# EAGLE design CompleteBoardAlternative (EAGLE 9.4.2)
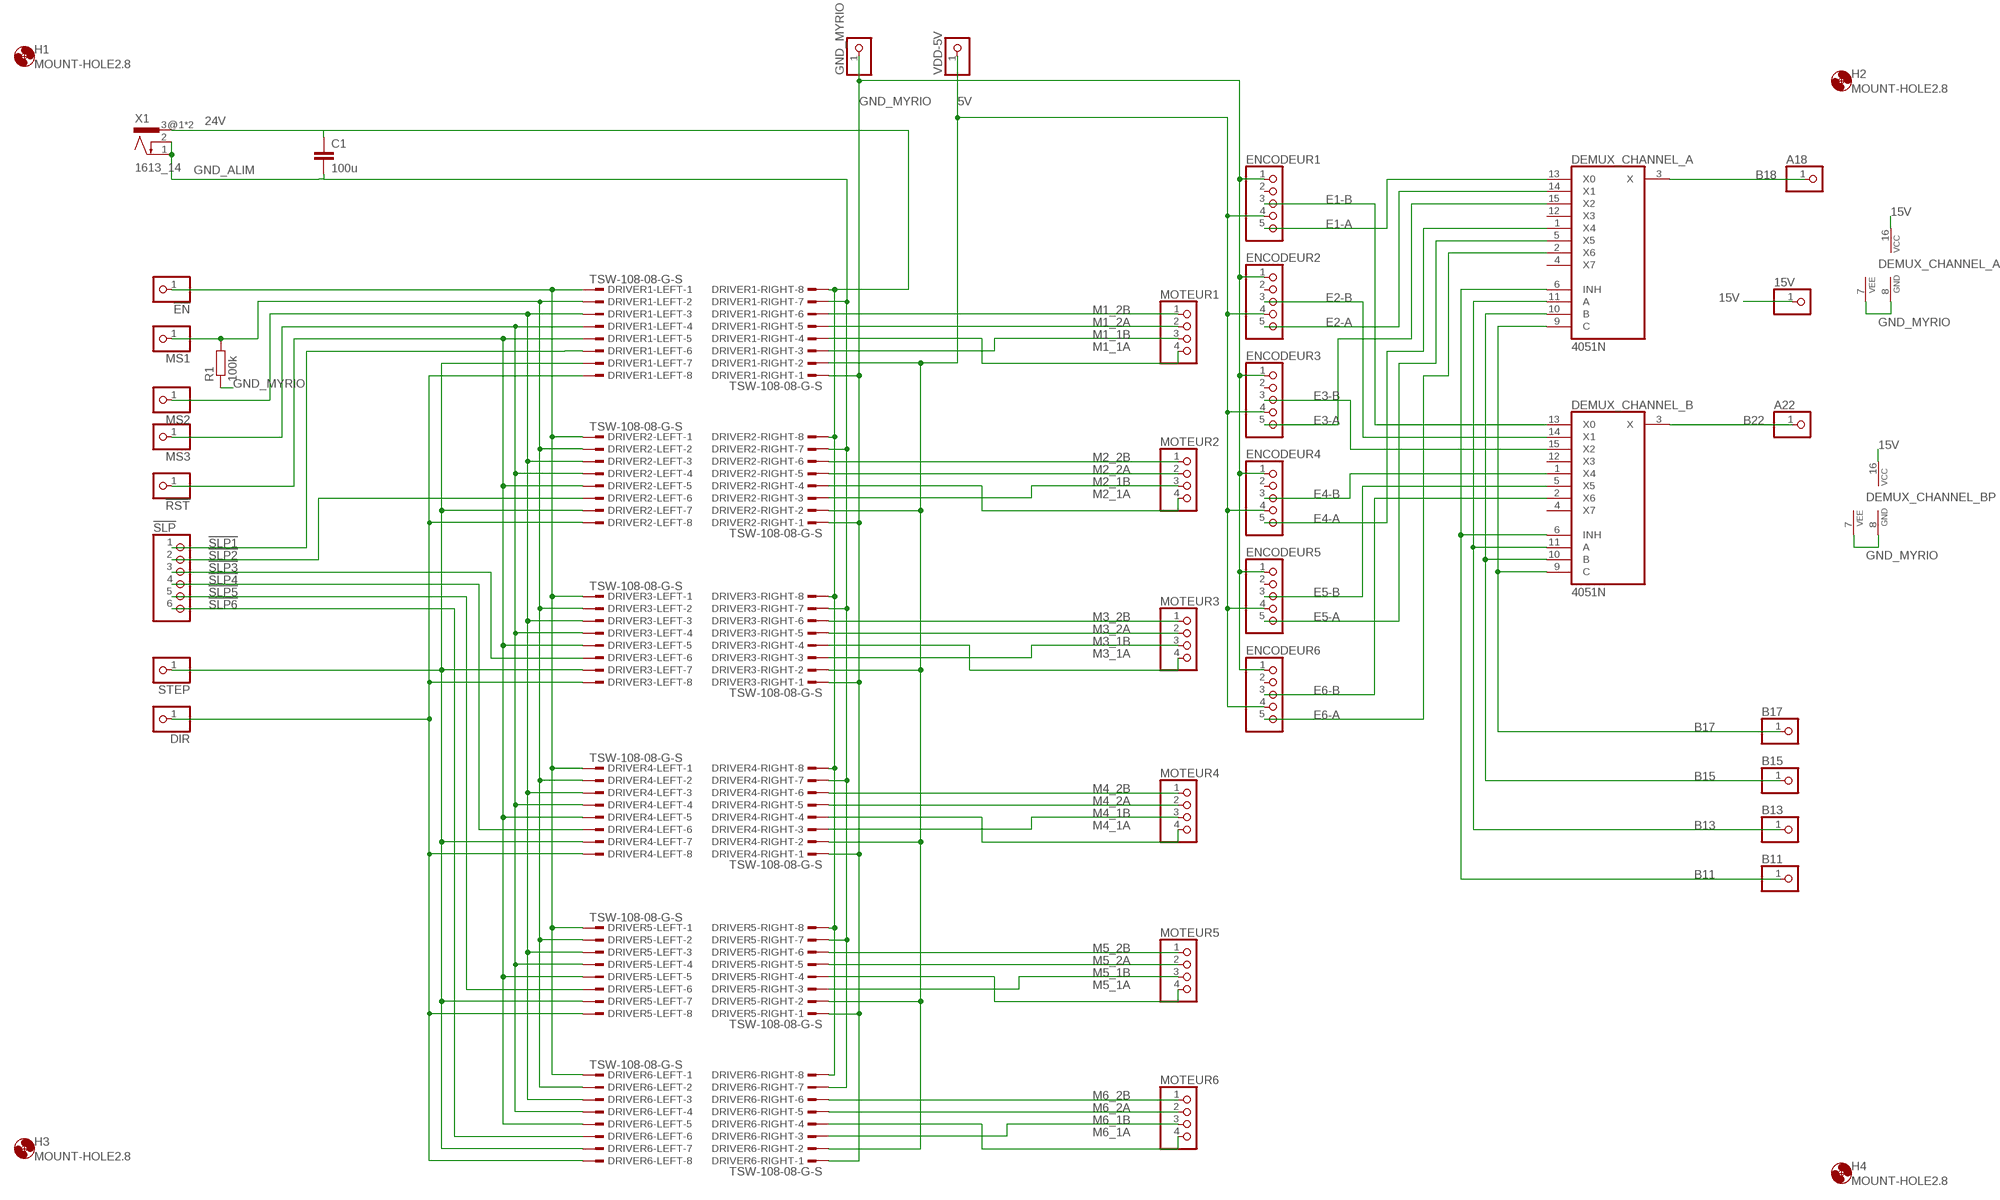
[diagram p0: schematic, sheet 1]

## Parts
15V  PINHD-1X1  [1X01]
!EN  PINHD-1X1  [1X01]
!RST  PINHD-1X1  [1X01]
!SLP  PINHD-1X6  [1X06]
A18  PINHD-1X1  [1X01]
A22  PINHD-1X1  [1X01]
B11  PINHD-1X1  [1X01]
B13  PINHD-1X1  [1X01]
B15  PINHD-1X1  [1X01]
B17  PINHD-1X1  [1X01]
C1  100u  C-EU025-025X050  [C025-025X050]
DEMUX_CHANNEL_A  4051N  [DIL16]
DEMUX_CHANNEL_B  4051N  [DIL16]
DIR  PINHD-1X1  [1X01]
DRIVER1-LEFT  TSW-108-08-G-S  [TSW-108-XX-G-S]
DRIVER1-RIGHT  TSW-108-08-G-S  [TSW-108-XX-G-S]
DRIVER2-LEFT  TSW-108-08-G-S  [TSW-108-XX-G-S]
DRIVER2-RIGHT  TSW-108-08-G-S  [TSW-108-XX-G-S]
DRIVER3-LEFT  TSW-108-08-G-S  [TSW-108-XX-G-S]
DRIVER3-RIGHT  TSW-108-08-G-S  [TSW-108-XX-G-S]
DRIVER4-LEFT  TSW-108-08-G-S  [TSW-108-XX-G-S]
DRIVER4-RIGHT  TSW-108-08-G-S  [TSW-108-XX-G-S]
DRIVER5-LEFT  TSW-108-08-G-S  [TSW-108-XX-G-S]
DRIVER5-RIGHT  TSW-108-08-G-S  [TSW-108-XX-G-S]
DRIVER6-LEFT  TSW-108-08-G-S  [TSW-108-XX-G-S]
DRIVER6-RIGHT  TSW-108-08-G-S  [TSW-108-XX-G-S]
ENCODEUR1  PINHD-1X5  [1X05]
ENCODEUR2  PINHD-1X5  [1X05]
ENCODEUR3  PINHD-1X5  [1X05]
ENCODEUR4  PINHD-1X5  [1X05]
ENCODEUR5  PINHD-1X5  [1X05]
ENCODEUR6  PINHD-1X5  [1X05]
GND_MYRIO  PINHD-1X1  [1X01]
H1  MOUNT-HOLE2.8  [2,8]
H2  MOUNT-HOLE2.8  [2,8]
H3  MOUNT-HOLE2.8  [2,8]
H4  MOUNT-HOLE2.8  [2,8]
MOTEUR1  PINHD-1X4  [1X04]
MOTEUR2  PINHD-1X4  [1X04]
MOTEUR3  PINHD-1X4  [1X04]
MOTEUR4  PINHD-1X4  [1X04]
MOTEUR5  PINHD-1X4  [1X04]
MOTEUR6  PINHD-1X4  [1X04]
MS1  PINHD-1X1  [1X01]
MS2  PINHD-1X1  [1X01]
MS3  PINHD-1X1  [1X01]
R1  100k  R-EU_0207/10  [0207/10]
STEP  PINHD-1X1  [1X01]
VDD-5V  PINHD-1X1  [1X01]
X1  1613_14  [1613_14]

## Nets
5V: DRIVER1-RIGHT.2 DRIVER2-RIGHT.2 DRIVER3-RIGHT.2 DRIVER4-RIGHT.2 DRIVER5-RIGHT.2 DRIVER6-RIGHT.2 ENCODEUR1.4 ENCODEUR2.4 ENCODEUR3.4 ENCODEUR4.4 ENCODEUR5.4 ENCODEUR6.4 VDD-5V.1
15V: 15V.1 DEMUX_CHANNEL_A.16(VCC) DEMUX_CHANNEL_B.16(VCC)
24V: C1.1 DRIVER1-RIGHT.8 DRIVER2-RIGHT.8 DRIVER3-RIGHT.8 DRIVER4-RIGHT.8 DRIVER5-RIGHT.8 DRIVER6-RIGHT.8 X1.3@1 X1.3@2
!ENABLE: !EN.1 DRIVER1-LEFT.1 DRIVER2-LEFT.1 DRIVER3-LEFT.1 DRIVER4-LEFT.1 DRIVER5-LEFT.1 DRIVER6-LEFT.1
!RESET: !RST.1 DRIVER1-LEFT.5 DRIVER2-LEFT.5 DRIVER3-LEFT.5 DRIVER4-LEFT.5 DRIVER5-LEFT.5 DRIVER6-LEFT.5
!SLP1: !SLP.1 DRIVER1-LEFT.6
!SLP2: !SLP.2 DRIVER2-LEFT.6
!SLP3: !SLP.3 DRIVER3-LEFT.6
!SLP4: !SLP.4 DRIVER4-LEFT.6
!SLP5: !SLP.5 DRIVER5-LEFT.6
!SLP6: !SLP.6 DRIVER6-LEFT.6
B11: B11.1 DEMUX_CHANNEL_A.6(INH) DEMUX_CHANNEL_B.6(INH)
B13: B13.1 DEMUX_CHANNEL_A.11(A) DEMUX_CHANNEL_B.11(A)
B15: B15.1 DEMUX_CHANNEL_A.10(B) DEMUX_CHANNEL_B.10(B)
B17: B17.1 DEMUX_CHANNEL_A.9(C) DEMUX_CHANNEL_B.9(C)
B18: A18.1 DEMUX_CHANNEL_A.3(X)
B22: A22.1 DEMUX_CHANNEL_B.3(X)
DIR: DIR.1 DRIVER1-LEFT.8 DRIVER2-LEFT.8 DRIVER3-LEFT.8 DRIVER4-LEFT.8 DRIVER5-LEFT.8 DRIVER6-LEFT.8
E1-A: DEMUX_CHANNEL_A.13(X0) ENCODEUR1.5
E1-B: DEMUX_CHANNEL_B.13(X0) ENCODEUR1.3
E2-A: DEMUX_CHANNEL_A.14(X1) ENCODEUR2.5
E2-B: DEMUX_CHANNEL_B.14(X1) ENCODEUR2.3
E3-A: DEMUX_CHANNEL_A.15(X2) ENCODEUR3.5
E3-B: DEMUX_CHANNEL_B.15(X2) ENCODEUR3.3
E4-A: DEMUX_CHANNEL_A.1(X4) ENCODEUR4.5
E4-B: DEMUX_CHANNEL_B.1(X4) ENCODEUR4.3
E5-A: DEMUX_CHANNEL_A.5(X5) ENCODEUR5.5
E5-B: DEMUX_CHANNEL_B.5(X5) ENCODEUR5.3
E6-A: DEMUX_CHANNEL_A.2(X6) ENCODEUR6.5
E6-B: DEMUX_CHANNEL_B.2(X6) ENCODEUR6.3
GND_ALIM: C1.2 DRIVER1-RIGHT.7 DRIVER2-RIGHT.7 DRIVER3-RIGHT.7 DRIVER4-RIGHT.7 DRIVER5-RIGHT.7 DRIVER6-RIGHT.7 X1.1 X1.2
GND_MYRIO: DEMUX_CHANNEL_A.7(VEE) DEMUX_CHANNEL_A.8(GND) DEMUX_CHANNEL_B.7(VEE) DEMUX_CHANNEL_B.8(GND) DRIVER1-RIGHT.1 DRIVER2-RIGHT.1 DRIVER3-RIGHT.1 DRIVER4-RIGHT.1 DRIVER5-RIGHT.1 DRIVER6-RIGHT.1 ENCODEUR1.1 ENCODEUR2.1 ENCODEUR3.1 ENCODEUR4.1 ENCODEUR5.1 ENCODEUR6.1 GND_MYRIO.1 R1.1
M1_1A: DRIVER1-RIGHT.4 MOTEUR1.4
M1_1B: DRIVER1-RIGHT.3 MOTEUR1.3
M1_2A: DRIVER1-RIGHT.5 MOTEUR1.2
M1_2B: DRIVER1-RIGHT.6 MOTEUR1.1
M2_1A: DRIVER2-RIGHT.4 MOTEUR2.4
M2_1B: DRIVER2-RIGHT.3 MOTEUR2.3
M2_2A: DRIVER2-RIGHT.5 MOTEUR2.2
M2_2B: DRIVER2-RIGHT.6 MOTEUR2.1
M3_1A: DRIVER3-RIGHT.4 MOTEUR3.4
M3_1B: DRIVER3-RIGHT.3 MOTEUR3.3
M3_2A: DRIVER3-RIGHT.5 MOTEUR3.2
M3_2B: DRIVER3-RIGHT.6 MOTEUR3.1
M4_1A: DRIVER4-RIGHT.4 MOTEUR4.4
M4_1B: DRIVER4-RIGHT.3 MOTEUR4.3
M4_2A: DRIVER4-RIGHT.5 MOTEUR4.2
M4_2B: DRIVER4-RIGHT.6 MOTEUR4.1
M5_1A: DRIVER5-RIGHT.4 MOTEUR5.4
M5_1B: DRIVER5-RIGHT.3 MOTEUR5.3
M5_2A: DRIVER5-RIGHT.5 MOTEUR5.2
M5_2B: DRIVER5-RIGHT.6 MOTEUR5.1
M6_1A: DRIVER6-RIGHT.4 MOTEUR6.4
M6_1B: DRIVER6-RIGHT.3 MOTEUR6.3
M6_2A: DRIVER6-RIGHT.5 MOTEUR6.2
M6_2B: DRIVER6-RIGHT.6 MOTEUR6.1
MS1: DRIVER1-LEFT.2 DRIVER2-LEFT.2 DRIVER3-LEFT.2 DRIVER4-LEFT.2 DRIVER5-LEFT.2 DRIVER6-LEFT.2 MS1.1 R1.2
MS2: DRIVER1-LEFT.3 DRIVER2-LEFT.3 DRIVER3-LEFT.3 DRIVER4-LEFT.3 DRIVER5-LEFT.3 DRIVER6-LEFT.3 MS2.1
MS3: DRIVER1-LEFT.4 DRIVER2-LEFT.4 DRIVER3-LEFT.4 DRIVER4-LEFT.4 DRIVER5-LEFT.4 DRIVER6-LEFT.4 MS3.1
STEP: DRIVER1-LEFT.7 DRIVER2-LEFT.7 DRIVER3-LEFT.7 DRIVER4-LEFT.7 DRIVER5-LEFT.7 DRIVER6-LEFT.7 STEP.1
Unconnected: DEMUX_CHANNEL_A.4(X7) DEMUX_CHANNEL_A.12(X3) DEMUX_CHANNEL_B.4(X7) DEMUX_CHANNEL_B.12(X3) ENCODEUR1.2 ENCODEUR2.2 ENCODEUR3.2 ENCODEUR4.2 ENCODEUR5.2 ENCODEUR6.2

## Library data of the parts
15V !EN !RST A18 A22 B11 B13 B15 B17 DIR GND_MYRIO MS1-MS3 STEP VDD-5V = pinhead:PINHD-1X1: PIN HEADER
!SLP = pinhead:PINHD-1X6: PIN HEADER
C1 = rcl:C-EU: CAPACITOR, European symbol; SPICEPREFIX: C
DEMUX_CHANNEL_A DEMUX_CHANNEL_B = 40xx:4051: 8-channel ANALOG MULTIPLEXER
DRIVER1-LEFT DRIVER1-RIGHT DRIVER2-LEFT DRIVER2-RIGHT DRIVER3-LEFT DRIVER3-RIGHT DRIVER4-LEFT DRIVER4-RIGHT DRIVER5-LEFT DRIVER5-RIGHT DRIVER6-LEFT DRIVER6-RIGHT = con-samtec:TSW-108-*-G-S: THROUGH-HOLE .025" SQ POST HEADER Source: Samtec TSW.pdf; MF: Samtec Inc.; MPN: TSW-108-07-G-S
ENCODEUR1-ENCODEUR6 = pinhead:PINHD-1X5: PIN HEADER
H1-H4 = holes:MOUNT-HOLE: MOUNTING HOLE with drill center marker
MOTEUR1-MOTEUR6 = pinhead:PINHD-1X4: PIN HEADER
R1 = rcl:R-EU_: RESISTOR, European symbol; SPICEPREFIX: R
X1 = con-lumberg:1613_14: Power supply connectors / Netzgeräte-Steckverbinder Source: Data sheet <http://www.farnell.com/datasheets/1733496.pdf>; MF: LUMBERG; MPN: 1613 14; OC_FARNELL: 1243245

## Board
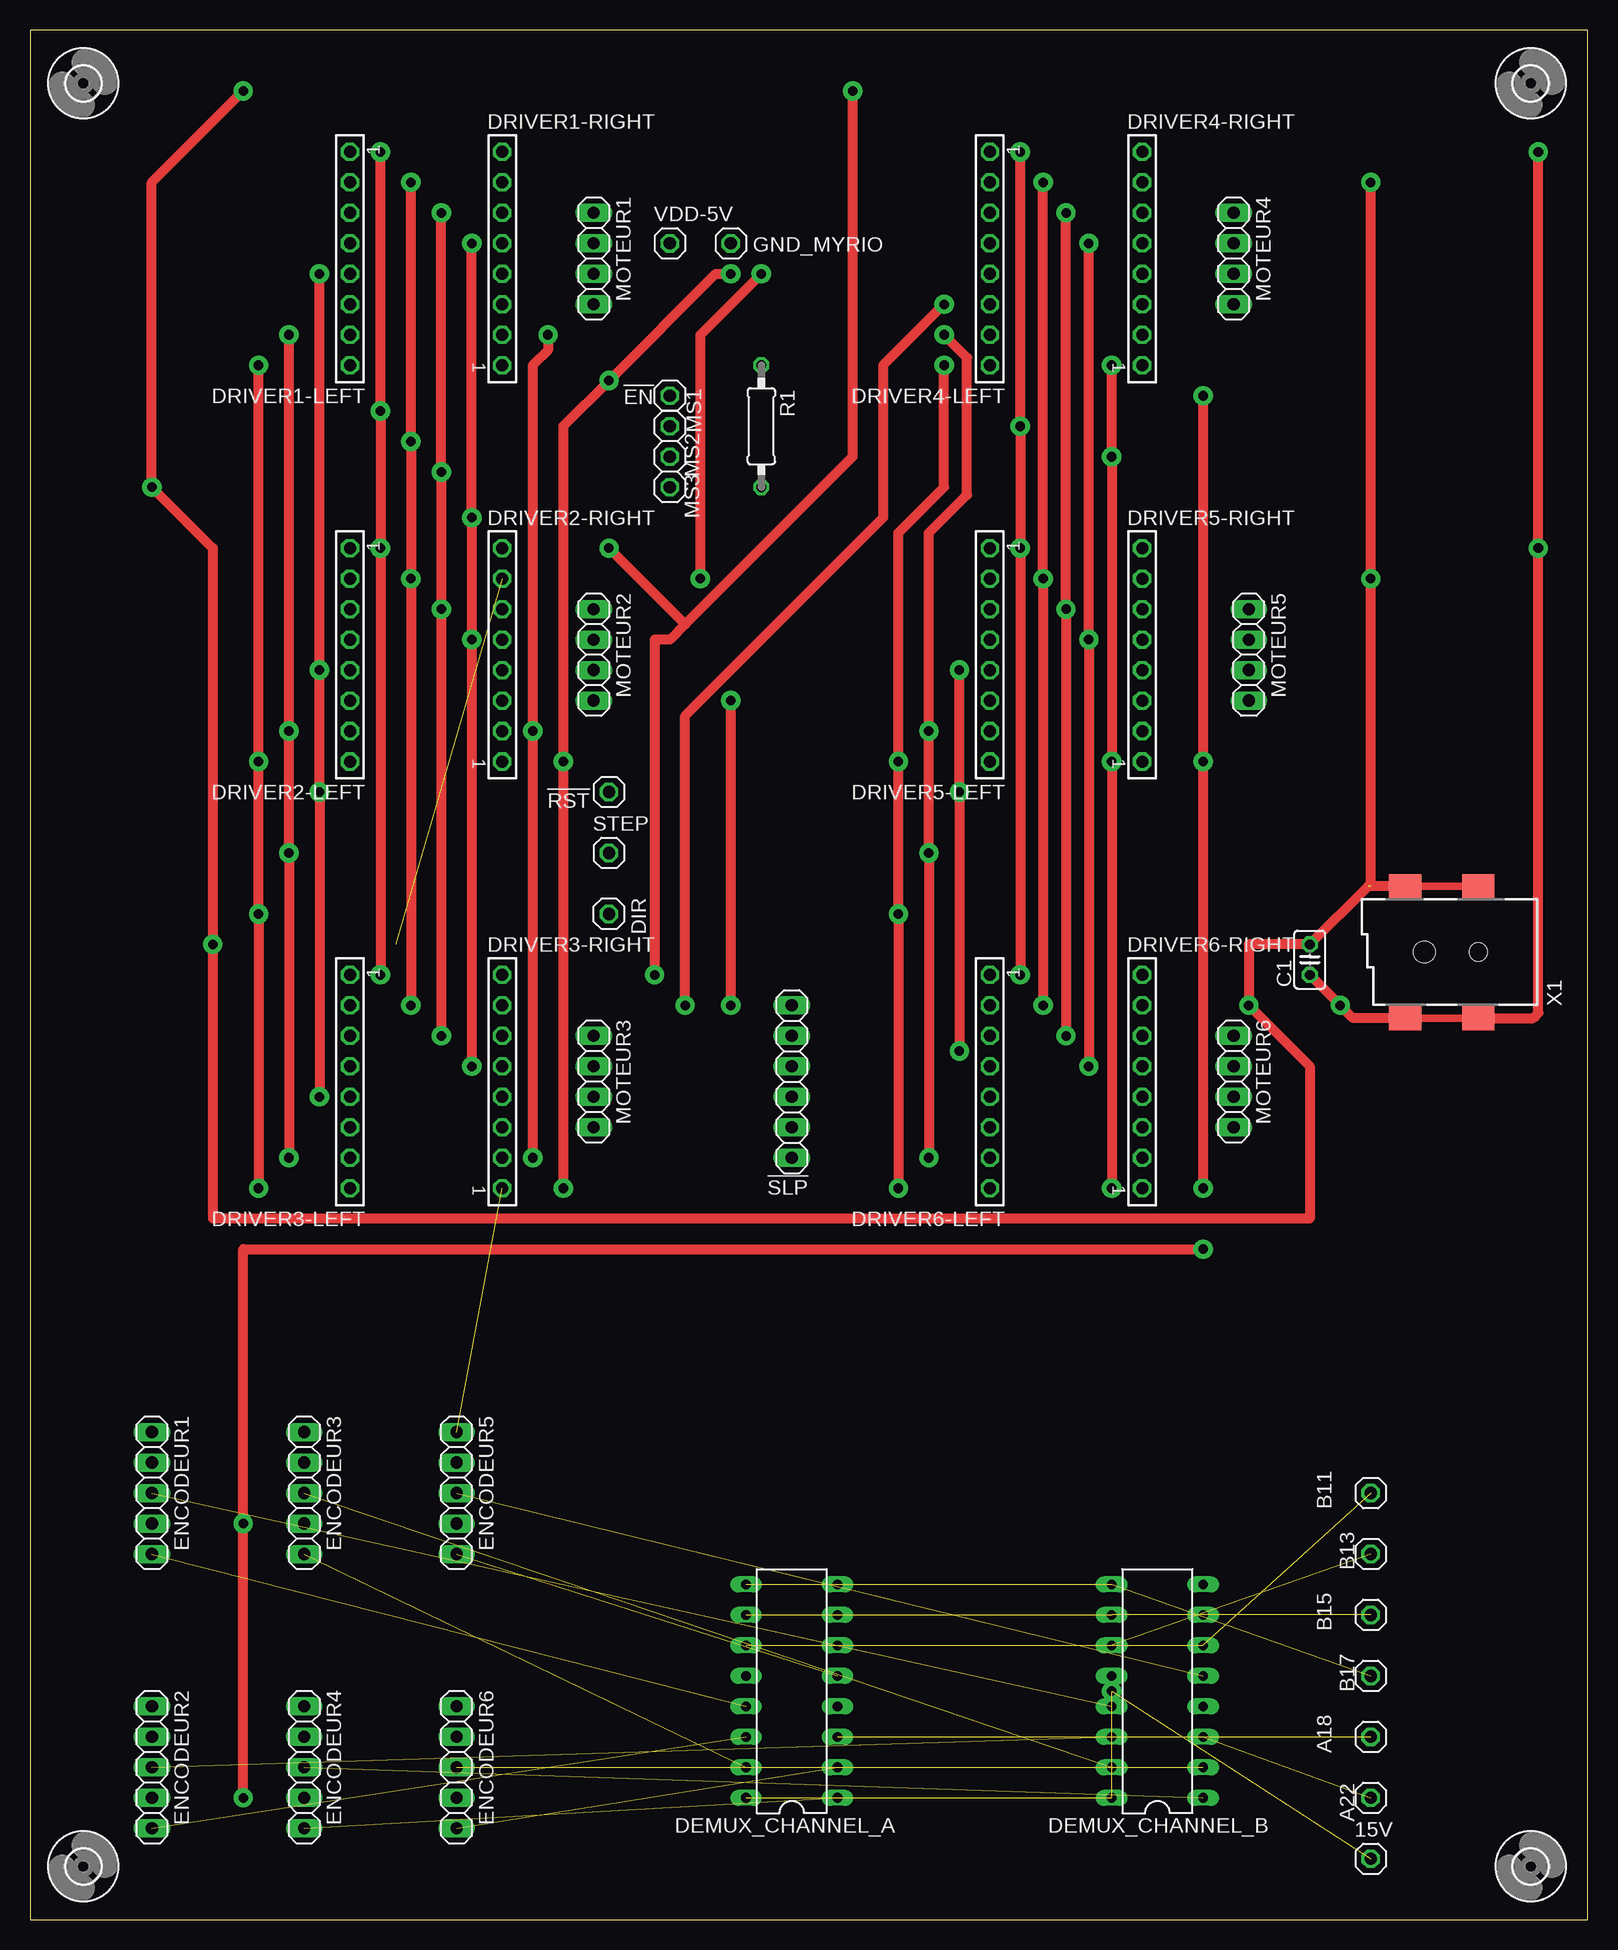
[diagram p1: board, top side]
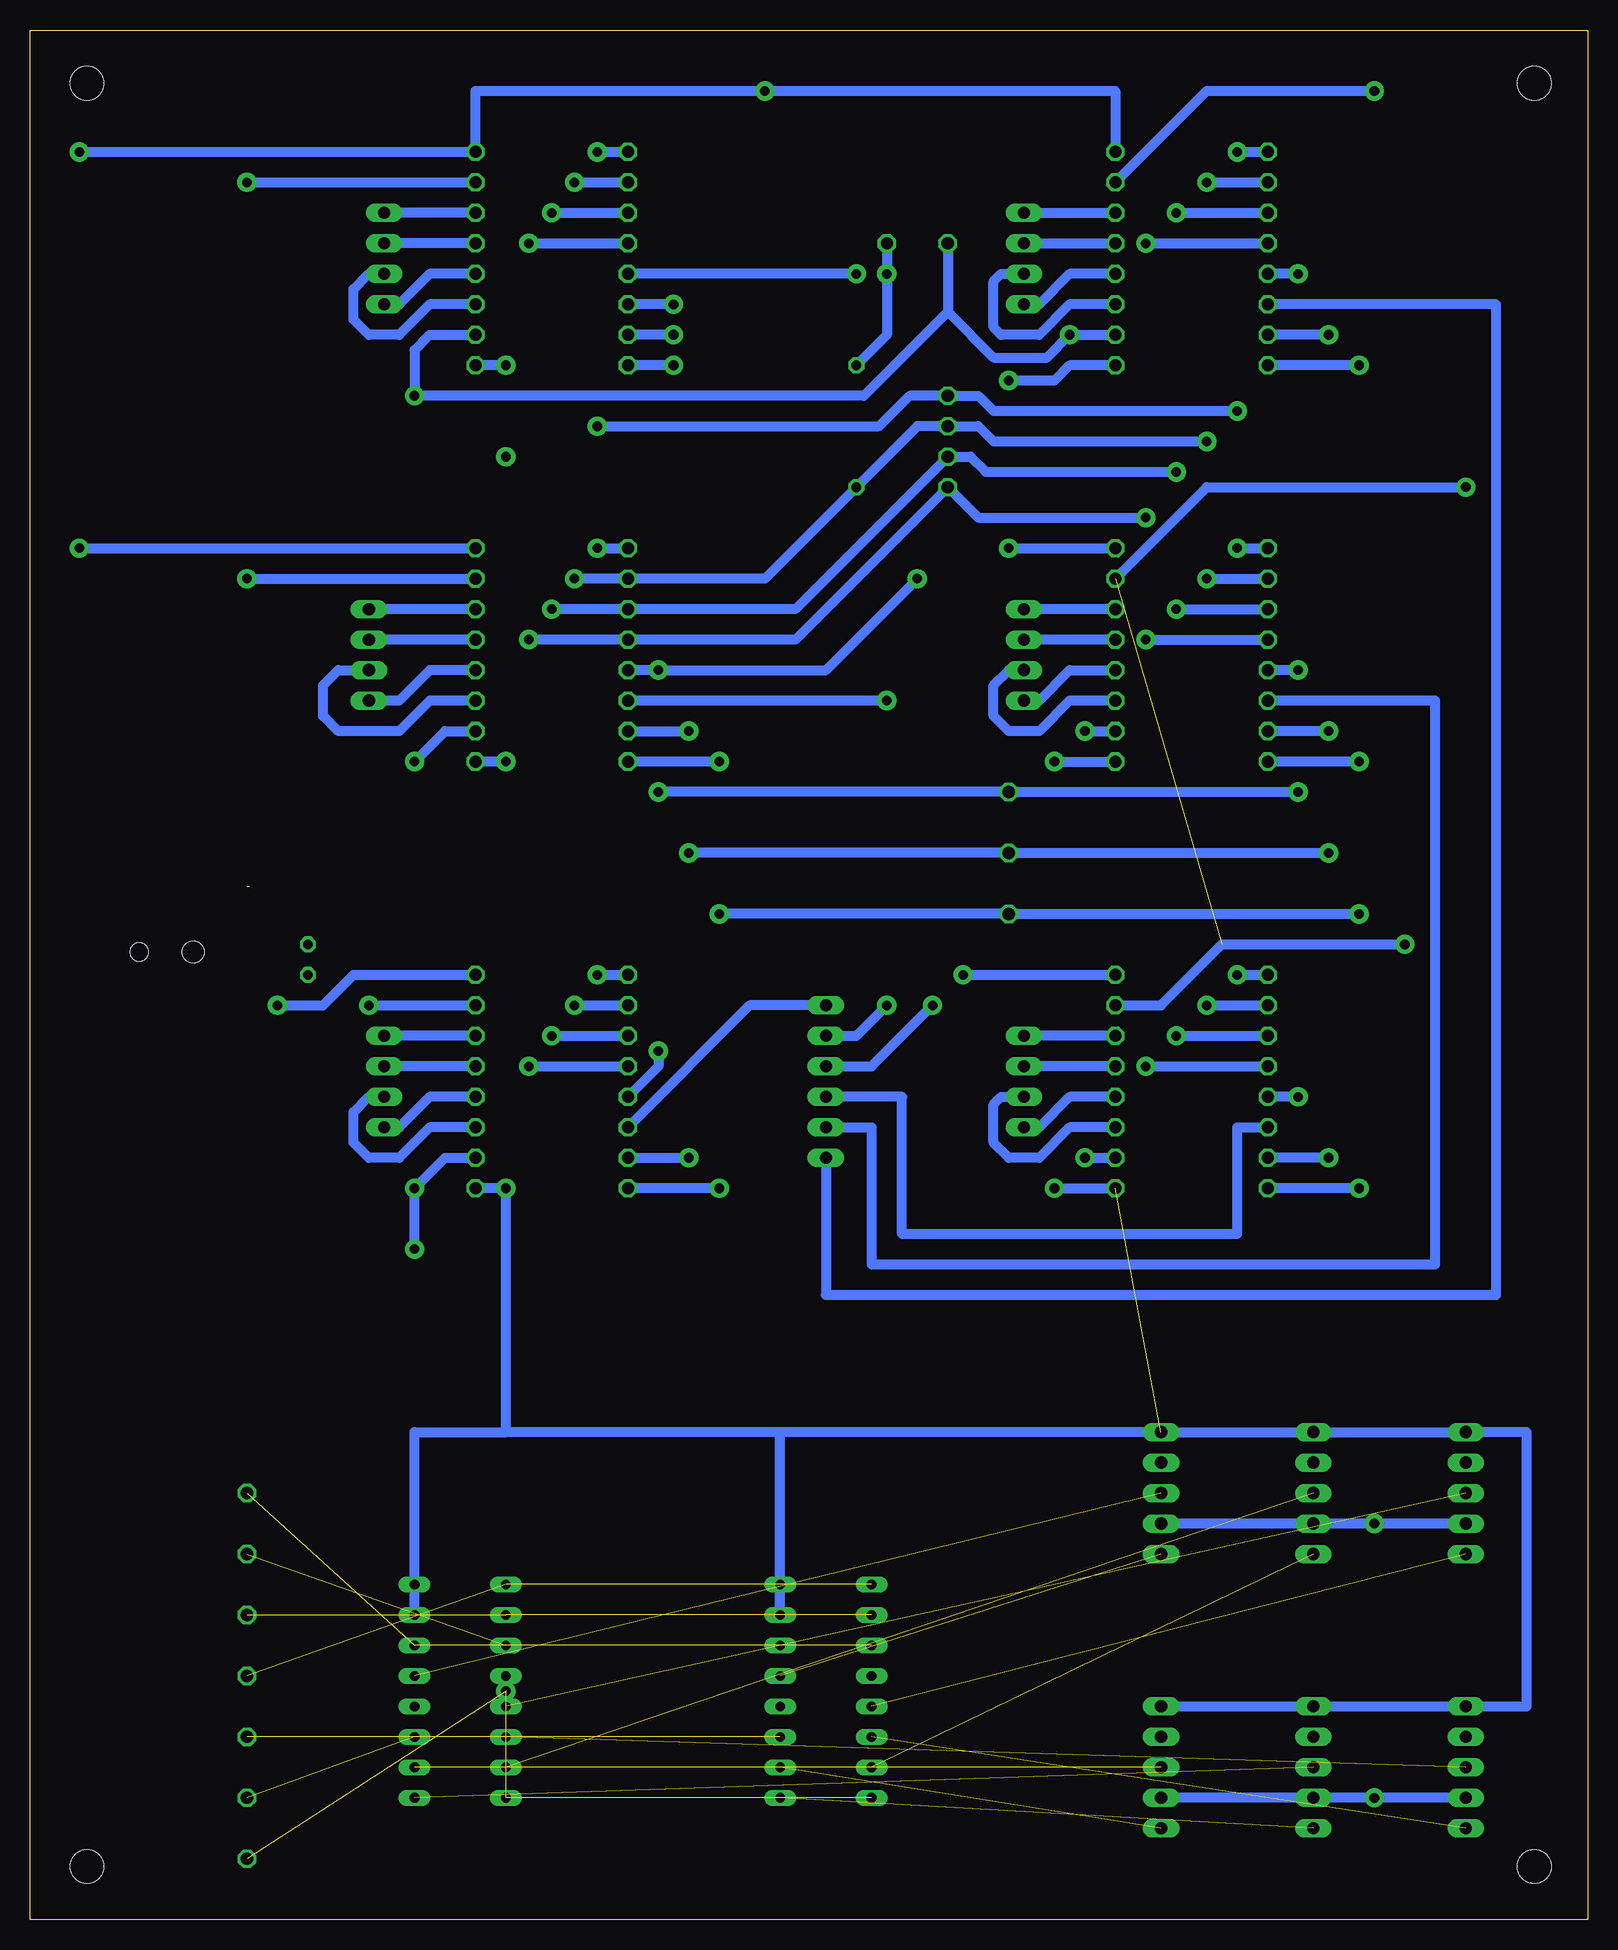
[diagram p2: board, bottom side, seen from below]

Size 129.84 x 157.48 mm. Coordinates in mm from the lower left corner, seen from the top.
Outline: 0,0 129.84,0 129.84,157.47 0,157.48 0,0
Copper layers (1*16): Top 0.035mm / dielectric 1.5mm / Bottom 0.035mm
Design rules "default": minimum track width 6mil, minimum drill 0.35mm, track to track 6mil, track to pad 6mil, pad to pad 6mil, via to via 6mil, smd to smd 6mil, copper to edge 40mil, drill to drill 6mil, minimum pad ring 10mil, minimum via ring 8mil, stop-mask expansion 4mil, vias tented up to drill 0mil, thermal gap 10mil

### Footprints (pad centres in the part's own frame; a part is rotated, then mirrored left to right if it is on the bottom)
1X01 = drill 1.016 octagon: 1 0,0
1X06 = drill 1.016 long: 1 -6.35,0; 2 -3.81,0; 3 -1.27,0; 4 1.27,0; 5 3.81,0; 6 6.35,0
C025-025X050 = drill 0.813 octagon: 1 -1.27,0; 2 1.27,0
DIL16 = drill 0.813 long: 1 -8.89,-3.81; 2 -6.35,-3.81; 3 -3.81,-3.81; 4 -1.27,-3.81; 5 1.27,-3.81; 6 3.81,-3.81; 7 6.35,-3.81; 8 8.89,-3.81; 9 8.89,3.81; 10 6.35,3.81; 11 3.81,3.81; 12 1.27,3.81; 13 -1.27,3.81; 14 -3.81,3.81; 15 -6.35,3.81; 16 -8.89,3.81
TSW-108-XX-G-S = drill 1 pad 1.5 octagon: 1 8.89,0; 2 6.35,0; 3 3.81,0; 4 1.27,0; 5 -1.27,0; 6 -3.81,0; 7 -6.35,0; 8 -8.89,0
1X05 = drill 1.016 long: 1 -5.08,0; 2 -2.54,0; 3 0,0; 4 2.54,0; 5 5.08,0
2,8 = hole 2.8: 0,0
1X04 = drill 1.016 long: 1 -3.81,0; 2 -1.27,0; 3 1.27,0; 4 3.81,0
0207/10 = drill 0.813 octagon: 1 -5.08,0; 2 5.08,0
1613_14 = smd 2 x 2.7: 1 5.5,5; 2 5.5,11.1; 3@1 -5.5,11.1; 3@2 -5.5,5 | hole 1.5: 0,5 | hole 1.8: 0,9.5

### Placement (x,y rotation side)
15V  111.76,5.08 0 top
!EN  53.34,127 270 top
!RST  48.26,93.98 0 top
!SLP  63.5,69.85 90 top
A18  111.76,15.24 0 top
A22  111.76,10.16 0 top
B11  111.76,35.56 0 top
B13  111.76,30.48 0 top
B15  111.76,25.4 0 top
B17  111.76,20.32 0 top
C1  106.68,80.01 90 top
DEMUX_CHANNEL_A  63.5,19.05 90 top
DEMUX_CHANNEL_B  93.98,19.05 90 top
DIR  48.26,83.82 270 top
DRIVER1-LEFT  26.67,138.43 90 top
DRIVER1-RIGHT  39.37,138.43 270 top
DRIVER2-LEFT  26.67,105.41 90 top
DRIVER2-RIGHT  39.37,105.41 270 top
DRIVER3-LEFT  26.67,69.85 90 top
DRIVER3-RIGHT  39.37,69.85 270 top
DRIVER4-LEFT  80.01,138.43 90 top
DRIVER4-RIGHT  92.71,138.43 270 top
DRIVER5-LEFT  80.01,105.41 90 top
DRIVER5-RIGHT  92.71,105.41 270 top
DRIVER6-LEFT  80.01,69.85 90 top
DRIVER6-RIGHT  92.71,69.85 270 top
ENCODEUR1  10.16,35.56 270 top
ENCODEUR2  10.16,12.7 270 top
ENCODEUR3  22.86,35.56 270 top
ENCODEUR4  22.86,12.7 270 top
ENCODEUR5  35.56,35.56 270 top
ENCODEUR6  35.56,12.7 270 top
GND_MYRIO  58.42,139.7 0 top
H1  4.45,153.03 0 top
H2  4.45,4.45 0 top
H3  125.09,153.03 0 top
H4  125.09,4.45 0 top
MOTEUR1  46.99,138.43 270 top
MOTEUR2  46.99,105.41 270 top
MOTEUR3  46.99,69.85 270 top
MOTEUR4  100.33,138.43 270 top
MOTEUR5  101.6,105.41 270 top
MOTEUR6  100.33,69.85 270 top
MS1  53.34,124.46 270 top
MS2  53.34,121.92 270 top
MS3  53.34,119.38 270 top
R1  60.96,124.46 270 top
STEP  48.26,88.9 0 top
VDD-5V  53.34,139.7 0 top
X1  125.73,80.64 90 top

### Tracks (layer width: path | path; a pad name or v marks a point on that pad's centre or on a via)
5V  (via drill 0.8 pad 1.6)
  Top 0.813: v97.79,127 v97.79,96.52 v97.79,60.96 | v43.18,132.08 43.18,130.81 41.91,129.54 v41.91,99.06 v41.91,63.5 | v17.78,10.16 v17.78,33.02 17.78,55.88 v97.79,55.88
  Bottom 0.813: VDD-5V.1 53.34,133.99 | 53.34,133.99 49.53,130.18 45.09,130.18 v43.18,132.08 DRIVER1-RIGHT.2 | DRIVER4-RIGHT.2 96.52,132.08 97.79,130.81 v97.79,127 60.33,127 53.34,133.99 | DRIVER6-RIGHT.2 95.25,63.5 v97.79,60.96 v97.79,55.88 | v97.79,96.52 95.25,99.06 DRIVER5-RIGHT.2 | v41.91,63.5 DRIVER3-RIGHT.2 | v41.91,99.06 DRIVER2-RIGHT.2 | ENCODEUR2.4 v17.78,10.16 ENCODEUR4.4 ENCODEUR6.4 | ENCODEUR1.4 v17.78,33.02 ENCODEUR3.4 ENCODEUR5.4
15V  (via drill 0.8 pad 1.6)  (3 unrouted)
  other vias: 90.17,19.05
24V  (via drill 0.8 pad 1.6)
  Top 0.61: X1.3@2 X1.3@1
  Top 0.813: X1.3@1 110.28,75.14 v109.22,76.2 C1.1 | X1.3@2 125.31,75.14 125.73,75.56 v125.73,114.3 v125.73,147.32 | v68.58,152.4 68.58,121.92 54.61,107.95 | 54.61,107.95 53.34,106.68 52.07,106.68 v52.07,78.74 | 54.61,107.95 v48.26,114.3
  Bottom 0.813: v109.22,76.2 105.41,76.2 102.87,78.74 DRIVER6-RIGHT.8 | v125.73,147.32 DRIVER4-RIGHT.8 92.71,152.4 v68.58,152.4 39.37,152.4 DRIVER1-RIGHT.8 | v125.73,114.3 DRIVER5-RIGHT.8 | v48.26,114.3 DRIVER2-RIGHT.8 | v52.07,78.74 DRIVER3-RIGHT.8
!ENABLE  (via drill 0.8 pad 1.6)
  Top 0.813: v29.21,147.32 v29.21,125.73 v29.21,114.3 v29.21,78.74 | v82.55,78.74 v82.55,114.3 v82.55,124.46 v82.55,147.32
  Bottom 0.813: v29.21,125.73 49.53,125.73 50.8,127 !EN.1 56.52,127 59.05,124.46 v82.55,124.46 | v29.21,78.74 DRIVER3-LEFT.1 | v82.55,147.32 DRIVER4-LEFT.1 | v82.55,114.3 DRIVER5-LEFT.1 | v82.55,78.74 DRIVER6-LEFT.1 | v29.21,114.3 DRIVER2-LEFT.1 | v29.21,147.32 DRIVER1-LEFT.1
!RESET  (via drill 0.8 pad 1.6)
  Top 0.813: v24.13,137.16 v24.13,104.14 v24.13,93.98 v24.13,68.58 | v77.47,72.39 v77.47,93.98 v77.47,104.14 | v55.88,111.76 55.88,132.08 v60.96,137.16
  Bottom 0.813: v24.13,93.98 !RST.1 v77.47,93.98 | v24.13,68.58 DRIVER3-LEFT.5 | v24.13,104.14 DRIVER2-LEFT.5 | v24.13,137.16 DRIVER1-LEFT.5 | DRIVER5-LEFT.5 v77.47,104.14 63.5,104.14 v55.88,111.76 | v77.47,72.39 77.47,71.12 DRIVER6-LEFT.5 | v60.96,137.16 DRIVER4-LEFT.5
!SLP1
  Bottom 0.813: !SLP.1 63.5,52.07 7.62,52.07 7.62,134.62 DRIVER1-LEFT.6
!SLP2
  Bottom 0.813: !SLP.2 59.69,66.04 59.69,54.61 12.7,54.61 12.7,101.6 DRIVER2-LEFT.6
!SLP3
  Bottom 0.813: DRIVER3-LEFT.6 29.21,66.04 29.21,57.15 57.15,57.15 57.15,68.58 !SLP.3
!SLP4  (via drill 0.8 pad 1.6)
  Top 0.813: v54.61,76.2 54.61,100.33 71.12,116.84 71.12,129.54 v76.2,134.62
  Bottom 0.813: !SLP.4 59.69,71.12 v54.61,76.2 | v76.2,134.62 DRIVER4-LEFT.6
!SLP5  (via drill 0.8 pad 1.6)
  Top 0.813: v58.42,76.2 v58.42,101.6
  Bottom 0.813: !SLP.5 60.96,73.66 v58.42,76.2 | v58.42,101.6 DRIVER5-LEFT.6
!SLP6
  Bottom 0.813: !SLP.6 69.85,76.2 DRIVER6-LEFT.6
B11  (2 unrouted)
B13  (2 unrouted)
B15  (2 unrouted)
B17  (2 unrouted)
B18  (1 unrouted)
B22  (1 unrouted)
DIR  (via drill 0.8 pad 1.6)
  Top 0.813: v19.05,129.54 v19.05,96.52 v19.05,83.82 v19.05,60.96 | v72.39,60.96 v72.39,83.82 v72.39,96.52 72.39,115.57 76.2,119.38 v76.2,129.54
  Bottom 0.813: v19.05,83.82 DIR.1 v72.39,83.82 | v19.05,60.96 DRIVER3-LEFT.8 | v19.05,96.52 DRIVER2-LEFT.8 | v19.05,129.54 DRIVER1-LEFT.8 | v76.2,129.54 DRIVER4-LEFT.8 | v72.39,96.52 DRIVER5-LEFT.8 | v72.39,60.96 DRIVER6-LEFT.8
E1-A  (1 unrouted)
E1-B  (1 unrouted)
E2-A  (1 unrouted)
E2-B  (1 unrouted)
E3-A  (1 unrouted)
E3-B  (1 unrouted)
E4-A  (1 unrouted)
E4-B  (1 unrouted)
E5-A  (1 unrouted)
E5-B  (1 unrouted)
E6-A  (1 unrouted)
E6-B  (1 unrouted)
GND_ALIM  (via drill 0.8 pad 1.6)  (2 unrouted)
  Top 0.61: X1.1 X1.2 114.42,86.36
  Top 0.813: 111.55,86.14 C1.2 101.6,81.28 v101.6,76.2 106.68,71.12 106.68,58.42 15.24,58.42 v15.24,81.28 15.24,114.3 v10.16,119.38 10.16,144.78 v17.78,152.4 | X1.2 111.76,86.14 v111.76,111.76 v111.76,144.78
  Bottom 0.813: v101.6,76.2 DRIVER6-RIGHT.7 | v111.76,111.76 DRIVER5-RIGHT.7 | v111.76,144.78 DRIVER4-RIGHT.7 | DRIVER1-RIGHT.7 31.75,152.4 v17.78,152.4 | DRIVER2-RIGHT.7 31.75,119.38 v10.16,119.38 | DRIVER3-RIGHT.7 35.56,76.2 30.48,81.28 v15.24,81.28
GND_MYRIO  (via drill 0.8 pad 1.6)  (1 unrouted)
  Top 0.813: v90.17,129.54 v90.17,121.92 v90.17,96.52 v90.17,60.96 | v58.42,137.16 57.15,137.16 v48.26,128.27 44.45,124.46 v44.45,96.52 v44.45,60.96
  Bottom 0.813: v90.17,129.54 DRIVER4-RIGHT.1 | v90.17,96.52 DRIVER5-RIGHT.1 | DRIVER6-RIGHT.1 v90.17,60.96 90.17,40.64 | R1.1 58.42,132.08 v58.42,137.16 GND_MYRIO.1 | DRIVER1-RIGHT.1 43.18,129.54 44.45,128.27 v48.26,128.27 | v44.45,60.96 DRIVER3-RIGHT.1 | v44.45,96.52 DRIVER2-RIGHT.1 | 67.31,40.64 ENCODEUR5.1 ENCODEUR3.1 ENCODEUR1.1 5.08,40.64 5.08,17.78 ENCODEUR2.1 ENCODEUR4.1 ENCODEUR6.1 | 67.31,40.64 90.17,40.64 | DEMUX_CHANNEL_A.7 DEMUX_CHANNEL_A.8 67.31,40.64 | DEMUX_CHANNEL_B.7 DEMUX_CHANNEL_B.8 97.79,40.64 90.17,40.64
M1_1A
  Bottom 0.813: DRIVER1-RIGHT.4 43.18,137.16 45.72,134.62 MOTEUR1.4
M1_1B
  Bottom 0.813: DRIVER1-RIGHT.3 43.18,134.62 45.72,132.08 48.9,132.08 49.53,132.72 49.53,136.53 48.9,137.16 MOTEUR1.3
M1_2A
  Bottom 0.813: MOTEUR1.2 DRIVER1-RIGHT.5
M1_2B
  Bottom 0.813: MOTEUR1.1 DRIVER1-RIGHT.6
M2_1A
  Bottom 0.813: MOTEUR2.4 45.72,101.6 43.18,104.14 DRIVER2-RIGHT.4
M2_1B
  Bottom 0.813: DRIVER2-RIGHT.3 43.18,101.6 45.72,99.06 48.26,99.06 49.53,100.33 49.53,102.87 48.26,104.14 MOTEUR2.3
M2_2A
  Bottom 0.813: DRIVER2-RIGHT.5 MOTEUR2.2
M2_2B
  Bottom 0.813: DRIVER2-RIGHT.6 MOTEUR2.1
M3_1A
  Bottom 0.813: DRIVER3-RIGHT.4 43.18,68.58 45.72,66.04 MOTEUR3.4
M3_1B
  Bottom 0.813: DRIVER3-RIGHT.3 43.18,66.04 45.72,63.5 48.26,63.5 49.53,64.77 49.53,67.94 48.9,68.58 MOTEUR3.3
M3_2A
  Bottom 0.813: DRIVER3-RIGHT.5 MOTEUR3.2
M3_2B
  Bottom 0.813: DRIVER3-RIGHT.6 MOTEUR3.1
M4_1A
  Bottom 0.813: DRIVER4-RIGHT.4 96.52,137.16 99.06,134.62 MOTEUR4.4
M4_1B
  Bottom 0.813: DRIVER4-RIGHT.3 96.52,134.62 99.06,132.08 101.6,132.08 102.87,133.35 102.87,135.89 101.6,137.16 MOTEUR4.3
M4_2A
  Bottom 0.813: DRIVER4-RIGHT.5 MOTEUR4.2
M4_2B
  Bottom 0.813: DRIVER4-RIGHT.6 MOTEUR4.1
M5_1A
  Bottom 0.813: DRIVER5-RIGHT.4 96.52,104.14 99.06,101.6 MOTEUR5.4
M5_1B
  Bottom 0.813: DRIVER5-RIGHT.3 96.52,101.6 99.06,99.06 104.14,99.06 105.41,100.33 105.41,102.87 104.14,104.14 MOTEUR5.3
M5_2A
  Bottom 0.813: DRIVER5-RIGHT.5 MOTEUR5.2
M5_2B
  Bottom 0.813: DRIVER5-RIGHT.6 MOTEUR5.1
M6_1A
  Bottom 0.813: DRIVER6-RIGHT.4 96.52,68.58 99.06,66.04 MOTEUR6.4
M6_1B
  Bottom 0.813: DRIVER6-RIGHT.3 96.52,66.04 99.06,63.5 101.6,63.5 102.87,64.77 102.87,67.31 101.6,68.58 MOTEUR6.3
M6_2A
  Bottom 0.813: DRIVER6-RIGHT.5 MOTEUR6.2
M6_2B
  Bottom 0.813: DRIVER6-RIGHT.6 MOTEUR6.1
MS1  (via drill 0.8 pad 1.6)
  Top 0.813: v31.75,144.78 v31.75,123.19 v31.75,111.76 v31.75,76.2 | v84.45,144.78 v84.45,111.76 v84.45,76.2
  Bottom 0.813: v31.75,123.19 49.53,123.19 50.8,124.46 MS1.1 55.88,124.46 R1.2 68.58,111.76 DRIVER5-LEFT.2 v84.45,111.76 | v31.75,76.2 DRIVER3-LEFT.2 | v31.75,111.76 DRIVER2-LEFT.2 | v31.75,144.78 DRIVER1-LEFT.2 | v84.45,144.78 DRIVER4-LEFT.2 | v84.45,76.2 DRIVER6-LEFT.2
MS2  (via drill 0.8 pad 1.6)
  Top 0.813: v34.29,142.24 v34.29,120.65 v34.29,109.22 v34.29,73.66 | v86.36,142.24 v86.36,109.22 v86.36,73.66
  Bottom 0.813: v34.29,120.65 50.16,120.65 51.44,121.92 MS2.1 66.04,109.22 DRIVER5-LEFT.3 v86.36,109.22 | v34.29,73.66 DRIVER3-LEFT.3 | v34.29,109.22 DRIVER2-LEFT.3 | v34.29,142.24 DRIVER1-LEFT.3 | v86.36,142.24 DRIVER4-LEFT.3 | v86.36,73.66 DRIVER6-LEFT.3
MS3  (via drill 0.8 pad 1.6)
  Top 0.813: v36.83,139.7 v36.83,116.84 v36.83,106.68 v36.83,71.12 | v88.27,139.7 v88.27,106.68 v88.27,71.12
  Bottom 0.813: v36.83,116.84 50.8,116.84 MS3.1 66.04,106.68 DRIVER5-LEFT.4 v88.27,106.68 | v36.83,71.12 DRIVER3-LEFT.4 | v36.83,106.68 DRIVER2-LEFT.4 | v36.83,139.7 DRIVER1-LEFT.4 | v88.27,139.7 DRIVER4-LEFT.4 | v88.27,71.12 DRIVER6-LEFT.4
STEP  (via drill 0.8 pad 1.6)
  Top 0.813: v21.59,132.08 v21.59,99.06 v21.59,88.9 v21.59,63.5 | v74.93,63.5 v74.93,88.9 v74.93,99.06 74.93,115.57 78.11,118.75 78.11,130.18 v76.2,132.08
  Bottom 0.813: v21.59,88.9 STEP.1 v74.93,88.9 | v21.59,63.5 DRIVER3-LEFT.7 | v21.59,99.06 DRIVER2-LEFT.7 | v21.59,132.08 DRIVER1-LEFT.7 | v76.2,132.08 DRIVER4-LEFT.7 | DRIVER5-LEFT.7 v74.93,99.06 | DRIVER6-LEFT.7 v74.93,63.5